# Altium project HV_BMS.PrjPcb (part 1 of 2)
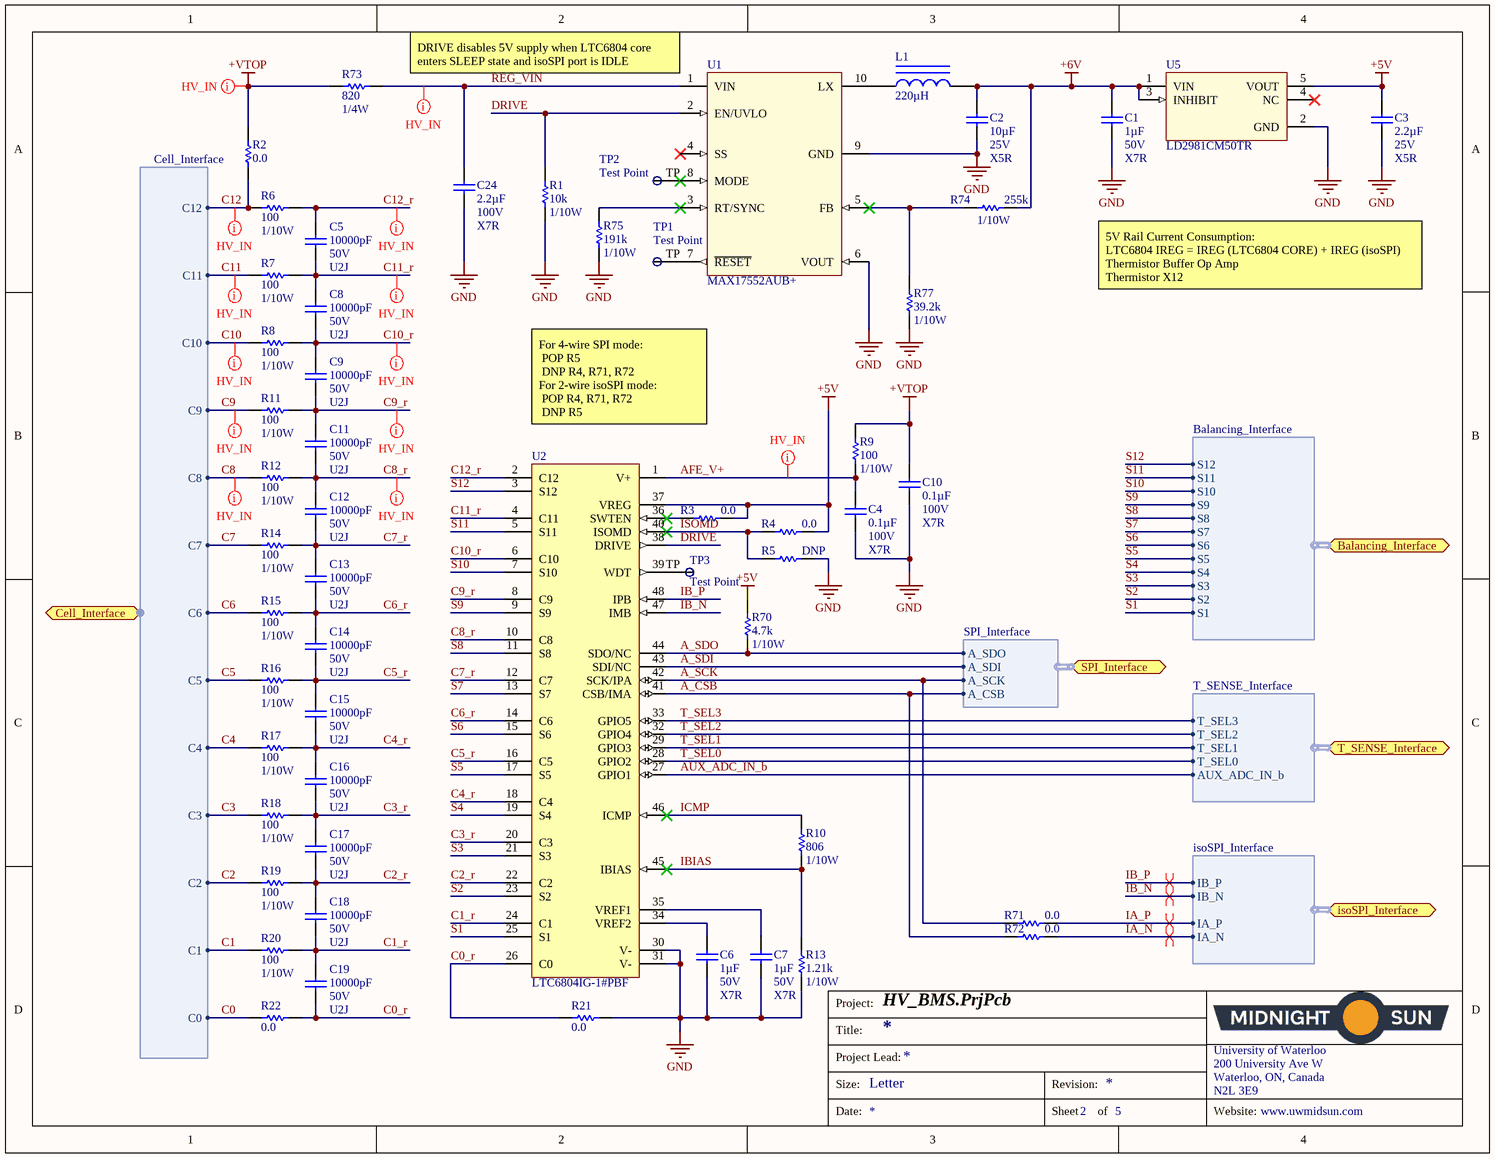
[diagram p0: AFE.SchDoc]
5 sheets, 128 parts. Net scope: flat (ports and power ports of the same name join across sheets).
Board file: AFE.PcbDoc
Sheets:
  BlockDiagram.SchDoc
  AFE.SchDoc
  Cell+Balancing_Interface.SchDoc
  Thermistor_Interface.SchDoc
  isoSPI_Interface.SchDoc

## Sheet BlockDiagram.SchDoc
size Letter

## Sheet AFE.SchDoc
size Letter; DocumentNumber: 2; SheetNumber: 2; SheetTotal: 5; Website: www.uwmidsun.com

### Parts
C1  Capacitance: 1µF  Voltage: 50V  Temperature Coefficient: X7R  [CAP, 0603]  (hidden comment: CAP CER 1UF 50V 10% X7R 0603)
C2  Capacitance: 10µF  Voltage: 25V  Temperature Coefficient: X5R  [CAP, 0603]  (hidden comment: CAP CER 10uF 25V 20% X5R 0603)
C3  Capacitance: 2.2µF  Voltage: 25V  Temperature Coefficient: X5R  [CAP, 0603]  (hidden comment: CAP CER 2.2UF 25V 10% X5R 0603)
C4  Capacitance: 0.1µF  Voltage: 100V  Temperature Coefficient: X7R  [CAP, 0805]  (hidden comment: CAP CER 0.1UF 100V 10% X7R 0805)
C5  Capacitance: 10000pF  Voltage: 50V  Temperature Coefficient: U2J  [CAP, 0603]  (hidden comment: CAP CER 10nF 50V 5% X7R 0603)
C6  Capacitance: 1µF  Voltage: 50V  Temperature Coefficient: X7R  [CAP, 0603]  (hidden comment: CAP CER 1UF 50V 10% X7R 0603)
C7  Capacitance: 1µF  Voltage: 50V  Temperature Coefficient: X7R  [CAP, 0603]  (hidden comment: CAP CER 1UF 50V 10% X7R 0603)
C8  Capacitance: 10000pF  Voltage: 50V  Temperature Coefficient: U2J  [CAP, 0603]  (hidden comment: CAP CER 10nF 50V 5% X7R 0603)
C9  Capacitance: 10000pF  Voltage: 50V  Temperature Coefficient: U2J  [CAP, 0603]  (hidden comment: CAP CER 10nF 50V 5% X7R 0603)
C10  Capacitance: 0.1µF  Voltage: 100V  Temperature Coefficient: X7R  [CAP, 0805]  (hidden comment: CAP CER 0.1UF 100V 10% X7R 0805)
C11  Capacitance: 10000pF  Voltage: 50V  Temperature Coefficient: U2J  [CAP, 0603]  (hidden comment: CAP CER 10nF 50V 5% X7R 0603)
C12  Capacitance: 10000pF  Voltage: 50V  Temperature Coefficient: U2J  [CAP, 0603]  (hidden comment: CAP CER 10nF 50V 5% X7R 0603)
C13  Capacitance: 10000pF  Voltage: 50V  Temperature Coefficient: U2J  [CAP, 0603]  (hidden comment: CAP CER 10nF 50V 5% X7R 0603)
C14  Capacitance: 10000pF  Voltage: 50V  Temperature Coefficient: U2J  [CAP, 0603]  (hidden comment: CAP CER 10nF 50V 5% X7R 0603)
C15  Capacitance: 10000pF  Voltage: 50V  Temperature Coefficient: U2J  [CAP, 0603]  (hidden comment: CAP CER 10nF 50V 5% X7R 0603)
C16  Capacitance: 10000pF  Voltage: 50V  Temperature Coefficient: U2J  [CAP, 0603]  (hidden comment: CAP CER 10nF 50V 5% X7R 0603)
C17  Capacitance: 10000pF  Voltage: 50V  Temperature Coefficient: U2J  [CAP, 0603]  (hidden comment: CAP CER 10nF 50V 5% X7R 0603)
C18  Capacitance: 10000pF  Voltage: 50V  Temperature Coefficient: U2J  [CAP, 0603]  (hidden comment: CAP CER 10nF 50V 5% X7R 0603)
C19  Capacitance: 10000pF  Voltage: 50V  Temperature Coefficient: U2J  [CAP, 0603]  (hidden comment: CAP CER 10nF 50V 5% X7R 0603)
C24  Capacitance: 2.2µF  Voltage: 100V  Temperature Coefficient: X7R  [CAP, 1206]  (hidden comment: CAP CER 2.2UF 100V ±20% X7R 1206)
L1  Inductance: 220µH  [INDP6060X23N]  (hidden comment: IND 220uH 0.59A 20%)
R1  Resistance: 10k  Power: 1/10W  [RES, 0603]  (hidden comment: RES 10K OHM 1% 1/10W 0603)
R2  Resistance: 0.0  [RES, 0603]  (hidden comment: RES 0.0 OHM 1/4W 0603)
R3  Resistance: 0.0  [RES, 0603]  (hidden comment: RES 0.0 OHM 1/4W 0603)
R4  Resistance: 0.0  [RES, 0603]  (hidden comment: RES 0.0 OHM 1/4W 0603)
R5  Resistance: DNP  [RES, 0603]  (hidden comment: RES 0.0 OHM 1/4W 0603)
R6  Resistance: 100  Power: 1/10W  [RES, 0603]  (hidden comment: RES 100 OHM 1% 1/10W 0603)
R7  Resistance: 100  Power: 1/10W  [RES, 0603]  (hidden comment: RES 100 OHM 1% 1/10W 0603)
R8  Resistance: 100  Power: 1/10W  [RES, 0603]  (hidden comment: RES 100 OHM 1% 1/10W 0603)
R9  Resistance: 100  Power: 1/10W  [RES, 0603]  (hidden comment: RES 100 OHM 1% 1/10W 0603)
R10  Resistance: 806  Power: 1/10W  [RES, 0603]  (hidden comment: RES 806 OHM 1% 1/10W 0603)
R11  Resistance: 100  Power: 1/10W  [RES, 0603]  (hidden comment: RES 100 OHM 1% 1/10W 0603)
R12  Resistance: 100  Power: 1/10W  [RES, 0603]  (hidden comment: RES 100 OHM 1% 1/10W 0603)
R13  Resistance: 1.21k  Power: 1/10W  [RES, 0603]  (hidden comment: RES 1.21K OHM 1% 1/10W 0603)
R14  Resistance: 100  Power: 1/10W  [RES, 0603]  (hidden comment: RES 100 OHM 1% 1/10W 0603)
R15  Resistance: 100  Power: 1/10W  [RES, 0603]  (hidden comment: RES 100 OHM 1% 1/10W 0603)
R16  Resistance: 100  Power: 1/10W  [RES, 0603]  (hidden comment: RES 100 OHM 1% 1/10W 0603)
R17  Resistance: 100  Power: 1/10W  [RES, 0603]  (hidden comment: RES 100 OHM 1% 1/10W 0603)
R18  Resistance: 100  Power: 1/10W  [RES, 0603]  (hidden comment: RES 100 OHM 1% 1/10W 0603)
R19  Resistance: 100  Power: 1/10W  [RES, 0603]  (hidden comment: RES 100 OHM 1% 1/10W 0603)
R20  Resistance: 100  Power: 1/10W  [RES, 0603]  (hidden comment: RES 100 OHM 1% 1/10W 0603)
R21  Resistance: 0.0  [RES, 0603]  (hidden comment: RES 0.0 OHM 1/4W 0603)
R22  Resistance: 0.0  [RES, 0603]  (hidden comment: RES 0.0 OHM 1/4W 0603)
R70  Resistance (Ohms): 4.7k  Power (Watts): 1/10W  [RES, 0603]  (hidden comment: RES 4.7K OHM 1% 1/10W 0603)
R71  Resistance: 0.0  [RES, 0603]  (hidden comment: RES 0.0 OHM 1/4W 0603)
R72  Resistance: 0.0  [RES, 0603]  (hidden comment: RES 0.0 OHM 1/4W 0603)
R73  Resistance: 820  Power: 1/4W  [RES, 0603]  (hidden comment: RES 820 OHM 5% 1/4W 0603)
R74  Resistance (Ohms): 255k  Power (Watts): 1/10W  [RES, 0603]  (hidden comment: RES 255K OHM 1% 1/10W 0603)
R75  Resistance: 191k  Power: 1/10W  [RES, 0603]  (hidden comment: RES 191K OHM 1% 1/10W 0603)
R77  Resistance: 39.2k  Power: 1/10W  [RES, 0603]  (hidden comment: RES 39.2K OHM 1% 1/10W 0603)
TP1  Test Point  [Test Point]
TP2  Test Point  [Test Point]
TP3  Test Point  [Test Point]
U1  Manufacturer Part Number 1: MAX17552AUB+  [TSSOP50P490X110-10N]  (hidden comment: IC REG BUCK ADJ 0.1A 10UMAX)
U2  Manufacturer Part Number 1: LTC6804IG-1#PBF  [SSOP50P780X200-48N]  (hidden comment: IC MONITOR BATT STACK 48SSOP)
U5  Manufacturer Part Number 1: LD2981CM50TR  [SOT95P280X145-5N]  (hidden comment: IC REG LDO 5V 0.1A SOT23-5)

### Ports
Balancing_Interface (harness Balancing_Interface), Cell_Interface (harness Cell_Interface), isoSPI_Interface (harness isoSPI_Interface), SPI_Interface (harness SPI_Interface), T_SENSE_Interface (harness T_SENSE_Interface)

### Harnesses
T_SENSE_Interface: AUX_ADC_IN_b, T_SEL0, T_SEL1, T_SEL2, T_SEL3
isoSPI_Interface: IB_P, IB_N, IA_P, IA_N
Cell_Interface: C12, C11, C10, C9, C8, C7, C6, C5, C4, C3, C2, C1, C0
Balancing_Interface: S12, S11, S10, S9, S8, S7, S6, S5, S4, S3, S2, S1
SPI_Interface: A_SDO, A_SDI, A_SCK, A_CSB

### Nets
+5V: C3.1 R3.1 R4.2 R70.1 U2.37(VREG) U5.5(VOUT)
+6V: C1.1 C2.1 L1.2 R74.2 U5.1(VIN) U5.3(INHIBIT)
+VTOP: C10.1 R2.1 R9.1 R73.1
GND: C1.2 C2.2 C3.2 C4.2 C6.2 C7.2 C10.2 C24.2 R1.2 R5.1 R13.2 R21.2 R75.2 R77.2 U1.6(VOUT) U1.9(GND) U2.30(V-) U2.31(V-) U5.2(GND)
A_CSB: R72.2 U2.41(CSB/IMA) ; port SPI_Interface.A_CSB
A_SCK: R71.2 U2.42(SCK/IPA) ; port SPI_Interface.A_SCK
A_SDI: U2.43(SDI/NC) ; port SPI_Interface.A_SDI
A_SDO: R70.2 U2.44(SDO/NC) ; port SPI_Interface.A_SDO
AFE_V+: C4.1 R9.2 U2.1(V+)
AUX_ADC_IN_b: U2.27(GPIO1) ; port T_SENSE_Interface.AUX_ADC_IN_b
C0: R22.1 ; port Cell_Interface.C0
C0_r: C19.2 R21.1 R22.2 U2.26(C0)
C1: R20.1 ; port Cell_Interface.C1
C1_r: C18.2 C19.1 R20.2 U2.24(C1)
C2: R19.1 ; port Cell_Interface.C2
C2_r: C17.2 C18.1 R19.2 U2.22(C2)
C3: R18.1 ; port Cell_Interface.C3
C3_r: C16.2 C17.1 R18.2 U2.20(C3)
C4: R17.1 ; port Cell_Interface.C4
C4_r: C15.2 C16.1 R17.2 U2.18(C4)
C5: R16.1 ; port Cell_Interface.C5
C5_r: C14.2 C15.1 R16.2 U2.16(C5)
C6: R15.1 ; port Cell_Interface.C6
C6_r: C13.2 C14.1 R15.2 U2.14(C6)
C7: R14.1 ; port Cell_Interface.C7
C7_r: C12.2 C13.1 R14.2 U2.12(C7)
C8: R12.1 ; port Cell_Interface.C8
C8_r: C11.2 C12.1 R12.2 U2.10(C8)
C9: R11.1 ; port Cell_Interface.C9
C9_r: C9.2 C11.1 R11.2 U2.8(C9)
C10: R8.1 ; port Cell_Interface.C10
C10_r: C8.2 C9.1 R8.2 U2.6(C10)
C11: R7.1 ; port Cell_Interface.C11
C11_r: C5.2 C8.1 R7.2 U2.4(C11)
C12: R2.2 R6.1 ; port Cell_Interface.C12
C12_r: C5.1 R6.2 U2.2(C12)
DRIVE: R1.1 U1.2(EN/UVLO) U2.38(DRIVE)
IA_N: R72.1 ; port isoSPI_Interface.IA_N
IA_P: R71.1 ; port isoSPI_Interface.IA_P
IB_N: U2.47(IMB) ; port isoSPI_Interface.IB_N
IB_P: U2.48(IPB) ; port isoSPI_Interface.IB_P
IBIAS: R10.2 R13.1 U2.45(IBIAS)
ICMP: R10.1 U2.46(ICMP)
ISOMD: R4.1 R5.2 U2.40(ISOMD)
REG_VIN: C24.1 R73.2 U1.1(VIN)
S1: U2.25(S1) ; port Balancing_Interface.S1
S2: U2.23(S2) ; port Balancing_Interface.S2
S3: U2.21(S3) ; port Balancing_Interface.S3
S4: U2.19(S4) ; port Balancing_Interface.S4
S5: U2.17(S5) ; port Balancing_Interface.S5
S6: U2.15(S6) ; port Balancing_Interface.S6
S7: U2.13(S7) ; port Balancing_Interface.S7
S8: U2.11(S8) ; port Balancing_Interface.S8
S9: U2.9(S9) ; port Balancing_Interface.S9
S10: U2.7(S10) ; port Balancing_Interface.S10
S11: U2.5(S11) ; port Balancing_Interface.S11
S12: U2.3(S12) ; port Balancing_Interface.S12
T_SEL0: U2.28(GPIO2) ; port T_SENSE_Interface.T_SEL0
T_SEL1: U2.29(GPIO3) ; port T_SENSE_Interface.T_SEL1
T_SEL2: U2.32(GPIO4) ; port T_SENSE_Interface.T_SEL2
T_SEL3: U2.33(GPIO5) ; port T_SENSE_Interface.T_SEL3
NetC6_1: C6.1 U2.34(VREF2)
NetC7_1: C7.1 U2.35(VREF1)
NetL1_1: L1.1 U1.10(LX)
NetR3_2: R3.2 U2.36(SWTEN)
NetR74_1: R74.1 R77.1 U1.5(FB)
NetR75_1: R75.1 U1.3(RT/SYNC)
NetTP1_TP: TP1.TP U1.7(~{RESET})
NetTP2_TP: TP2.TP U1.8(MODE)
NetTP3_TP: TP3.TP U2.39(WDT)

Not connected (* = marked no-connect by the designer): U1 4(SS)*; U5 4(NC)*

### Layout directives
differential pair: IA_N, IA_P, IB_N, IB_P
net class HV_IN: +VTOP, AFE_V+, C8, C8_r, C9, C9_r, C10, C10_r, C11, C11_r, C12, C12_r, REG_VIN

### Notes on the sheet
- DRIVE disables 5V supply when LTC6804 core enters SLEEP state and isoSPI port is IDLE
- 5V Rail Current Consumption:
  LTC6804 IREG = IREG (LTC6804 CORE) + IREG (isoSPI)
  Thermistor Buffer Op Amp
  Thermistor X12
- For 4-wire SPI mode:
  POP R5
  DNP R4, R71, R72
  For 2-wire isoSPI mode:
  POP R4, R71, R72
  DNP R5
- Project:
- Title:
- Size:
- Project Lead:
- Letter
- Revision:
- University of Waterloo
- 200 University Ave W
- Waterloo, ON, Canada
- N2L 3E9
- Date:
- Sheet
- of
- Website:

### Library data of the parts
C1 C6 C7 = CAP CER 1UF 50V 10% X7R 0603: 1µF ±10% 50V Ceramic Capacitor X7R 0603 (1608 Metric); Manufacturer 1: Taiyo Yuden; Manufacturer Part Number 1: UMK107AB7105KA-T; Supplier 1: Digi-Key; Supplier Part Number 1: 587-3247-1-ND; Packaging: Cut Tape (CT); Part Status: Active; Operating Temperature: -55°C ~ 125°C; Ratings: -; Mounting Type: Surface Mount, MLCC; Package / Case: 0603 (1608 Metric); Size / Dimension: 0.063" L x 0.031" W (1.60mm x 0.80mm); Height - Seated (Max): -; Thickness (Max): 0.037" (0.95mm); Lead Spacing: -; Lead Style: -; ComponentLink1URL: http://www.yuden.co.jp/productdata/catalog/en/mlcc_all_e.pdf; ComponentLink1Description: http://www.yuden.co.jp/productdata/catalog/en/mlcc_all_e.pdf; Tolerance: ±10%
C2 = CAP CER 10uF 25V 20% X5R 0603: 10µF ±20% 25V Ceramic Capacitor X5R 0603 (1608 Metric); Manufacturer 1: Murata Electronics North America; Manufacturer Part Number 1: GRM188R61E106MA73D; Supplier 1: Digi-Key; Supplier Part Number 1: 490-7202-1-ND; Packaging: Cut Tape (CT); Part Status: Active; Operating Temperature: -55°C ~ 85°C; Ratings: -; Mounting Type: Surface Mount, MLCC; Package / Case: 0603 (1608 Metric); Size / Dimension: 0.063" L x 0.031" W (1.60mm x 0.80mm); Height - Seated (Max): -; Thickness (Max): 0.031" (0.80mm); Lead Spacing: -; Lead Style: -; ComponentLink1URL: http://www.murata.com/~/media/webrenewal/support/library/catalog/products/capacitor/mlcc/c02e.ashx; ComponentLink1Description: http://www.murata.com/~/media/webrenewal/support/library/catalog/products/capacitor/mlcc/c02e.ashx; Tolerance: ±20%
C3 = CAP CER 2.2UF 25V 10% X5R 0603: 2.2µF ±10% 25V Ceramic Capacitor X5R 0603 (1608 Metric); Manufacturer 1: Murata Electronics North America; Manufacturer Part Number 1: GRM188R61E225KA12D; Supplier 1: Digi-Key; Supplier Part Number 1: 490-10731-1-ND; Packaging: Cut Tape (CT); Part Status: Active; Operating Temperature: -55°C ~ 85°C; Ratings: -; Mounting Type: Surface Mount, MLCC; Package / Case: 0603 (1608 Metric); Size / Dimension: 0.063" L x 0.031" W (1.60mm x 0.80mm); Height - Seated (Max): -; Thickness (Max): 0.035" (0.90mm); Lead Spacing: -; Lead Style: -; ComponentLink1URL: http://www.murata.com/~/media/webrenewal/support/library/catalog/products/capacitor/mlcc/c02e.ashx; ComponentLink1Description: http://www.murata.com/~/media/webrenewal/support/library/catalog/products/capacitor/mlcc/c02e.ashx; Tolerance: ±10%
C4 C10 = CAP CER 0.1UF 100V 10% X7R 0805: 0.1µF ±10% 100V Ceramic Capacitor X7R 0805 (2012 Metric); Manufacturer 1: Murata Electronics North America; Manufacturer Part Number 1: GCM21BR72A104KA37L; Supplier 1: Digi-Key; Supplier Part Number 1: 490-4789-1-ND; Packaging: Cut Tape (CT); Part Status: Active; Operating Temperature: -55°C ~ 125°C; Ratings: AEC-Q200; Mounting Type: Surface Mount, MLCC; Package / Case: 0805 (2012 Metric); Size / Dimension: 0.079" L x 0.049" W (2.00mm x 1.25mm); Height - Seated (Max): -; Thickness (Max): 0.055" (1.40mm); Lead Spacing: -; Lead Style: -; ComponentLink1URL: http://www.murata.com/~/media/webrenewal/support/library/catalog/products/capacitor/mlcc/c03e.ashx; ComponentLink1Description: http://www.murata.com/~/media/webrenewal/support/library/catalog/products/capacitor/mlcc/c03e.ashx; Tolerance: ±10%
C5 C8 C9 C11-C19 = CAP CER 10nF 50V 5% X7R 0603: 10000pF ±5% 50V Ceramic Capacitor U2J 0603 (1608 Metric); Manufacturer 1: KEMET; Manufacturer Part Number 1: C0603C103J5JAC7867; Supplier 1: Digi-Key; Supplier Part Number 1: 399-13384-1-ND; Packaging: Cut Tape (CT); Part Status: Active; Operating Temperature: -55°C ~ 125°C; Ratings: -; Failure Rate: -; Mounting Type: Surface Mount, MLCC; Package / Case: 0603 (1608 Metric); Size / Dimension: 0.063" L x 0.032" W (1.60mm x 0.80mm); Height - Seated (Max): -; Thickness (Max): 0.034" (0.87mm); Lead Spacing: -; Lead Style: -; ComponentLink1URL: http://www.kemet.com/docfinder?Partnumber=C0603C103J5JAC7867; ComponentLink1Description: http://www.kemet.com/docfinder?Partnumber=C0603C103J5JAC7867; Tolerance: ±5%
C24 = CAP CER 2.2UF 100V ±20% X7R 1206: 2.2µF ±20% 100V Ceramic Capacitor X7R 1206 (3216 Metric); Manufacturer 1: Murata Electronics North America; Manufacturer Part Number 1: GRM31CR72A225MA73L; Supplier 1: Digi-Key; Supplier Part Number 1: 490-12773-1-ND; Packaging: Cut Tape (CT); Part Status: Active; Operating Temperature: -55°C ~ 125°C; Ratings: -; Mounting Type: Surface Mount, MLCC; Package / Case: 1206 (3216 Metric); Size / Dimension: 0.126" L x 0.063" W (3.20mm x 1.60mm); Height - Seated (Max): -; Thickness (Max): 0.071" (1.80mm); Lead Spacing: -; Lead Style: -; ComponentLink1URL: http://www.murata.com/~/media/webrenewal/support/library/catalog/products/capacitor/mlcc/c02e.ashx; ComponentLink1Description: http://www.murata.com/~/media/webrenewal/support/library/catalog/products/capacitor/mlcc/c02e.ashx; Tolerance: ±20%
L1 = IND 220uH 0.59A 20%: 220µH Shielded Inductor 590mA 834 mOhm Nonstandard; Manufacturer 1: Laird-Signal Integrity Products; Manufacturer Part Number 1: TYS6045221M-10; Current - Saturation: 700mA; Frequency - Self Resonant: 3.5MHz; Supplier 1: Digi-Key; Supplier Part Number 1: 240-2742-1-ND; Packaging: Cut Tape (CT); Part Status: Active; Type: -; Material - Core: -; Current Rating: 590mA; Shielding: Shielded; DC Resistance (DCR): 834 mOhm; Q @ Freq: -; Ratings: AEC-Q200; Operating Temperature: -40°C ~ 125°C; Mounting Type: Surface Mount; Package / Case: Nonstandard; Supplier Device Package: -; Size / Dimension: 0.236" L x 0.236" W (6.00mm x 6.00mm); Height - Seated (Max): 0.185" (4.70mm); ComponentLink1URL: http://assets.lairdtech.com/home/brandworld/files/TYS6045221M-10.pdf; ComponentLink1Description: http://assets.lairdtech.com/home/brandworld/files/TYS6045221M-10.pdf; Tolerance: ±20%
R1 = RES 10K OHM 1% 1/10W 0603: RES SMD 10K OHM 1% 1/10W 0603; Manufacturer 1: Yageo; Manufacturer Part Number 1: RC0603FR-0710KL; Temperature Coefficient: ±100ppm/°C; Supplier 1: Digi-Key; Supplier Part Number 1: 311-10.0KHRCT-ND; Packaging: Cut Tape (CT); Part Status: Active; Composition: Thick Film; Operating Temperature: -55°C ~ 155°C; Package / Case: 0603 (1608 Metric); Supplier Device Package: 0603; Size / Dimension: 0.063" L x 0.031" W (1.60mm x 0.80mm); Height - Seated (Max): 0.022" (0.55mm); Failure Rate: -; ComponentLink1URL: http://www.yageo.com/documents/recent/PYu-RC_Group_51_RoHS_L_7.pdf; ComponentLink1Description: http://www.yageo.com/documents/recent/PYu-RC_Group_51_RoHS_L_7.pdf; Tolerance: ±1%
R2-R5 R21 R22 R71 R72 = RES 0.0 OHM 1/4W 0603: RES SMD 0.0 OHM JUMPER 1/4W 0603; Manufacturer 1: Vishay Dale; Manufacturer Part Number 1: CRCW06030000Z0EAHP; Supplier 1: Digi-Key; Supplier Part Number 1: 541-0.0SBCT-ND; Packaging: Cut Tape (CT); Part Status: Active; Composition: Thick Film; Operating Temperature: -55°C ~ 155°C; Package / Case: 0603 (1608 Metric); Supplier Device Package: 0603; Size / Dimension: 0.063" L x 0.033" W (1.60mm x 0.85mm); Height - Seated (Max): 0.022" (0.55mm); Failure Rate: -; ComponentLink1URL: http://www.vishay.com/docs/20043/crcwhpe3.pdf; ComponentLink1Description: http://www.vishay.com/docs/20043/crcwhpe3.pdf; Power (Watts): 1/4W
R6-R9 R11 R12 R14-R20 = RES 100 OHM 1% 1/10W 0603: 100 Ohm ±1% 0.1W, 1/10W Chip Resistor 0603 (1608 Metric) Moisture Resistant Thick Film; Manufacturer 1: Yageo; Manufacturer Part Number 1: RC0603FR-07100RL; Temperature Coefficient: ±100ppm/°C; Supplier 1: Digi-Key; Supplier Part Number 1: 311-100HRCT-ND; Packaging: Cut Tape (CT); Part Status: Active; Composition: Thick Film; Operating Temperature: -55°C ~ 155°C; Package / Case: 0603 (1608 Metric); Supplier Device Package: 0603; Size / Dimension: 0.063" L x 0.031" W (1.60mm x 0.80mm); Height - Seated (Max): 0.022" (0.55mm); Failure Rate: -; ComponentLink1URL: http://www.yageo.com/documents/recent/PYu-RC_Group_51_RoHS_L_7.pdf; ComponentLink1Description: http://www.yageo.com/documents/recent/PYu-RC_Group_51_RoHS_L_7.pdf; Tolerance: ±1%
R10 = RES 806 OHM 1% 1/10W 0603: 806 Ohm ±1% 0.1W, 1/10W Chip Resistor 0603 (1608 Metric) Moisture Resistant Thick Film; Manufacturer 1: Yageo; Manufacturer Part Number 1: RC0603FR-07806RL; Temperature Coefficient: ±100ppm/°C; Supplier 1: Digi-Key; Supplier Part Number 1: 311-806HRCT-ND; Packaging: Cut Tape (CT); Part Status: Active; Composition: Thick Film; Operating Temperature: -55°C ~ 155°C; Package / Case: 0603 (1608 Metric); Supplier Device Package: 0603; Size / Dimension: 0.063" L x 0.031" W (1.60mm x 0.80mm); Height - Seated (Max): 0.022" (0.55mm); Failure Rate: -; ComponentLink1URL: http://www.yageo.com/documents/recent/PYu-RC_Group_51_RoHS_L_7.pdf; ComponentLink1Description: http://www.yageo.com/documents/recent/PYu-RC_Group_51_RoHS_L_7.pdf; Tolerance: ±1%
R13 = RES 1.21K OHM 1% 1/10W 0603: 1.21k Ohm ±1% 0.1W, 1/10W Chip Resistor 0603 (1608 Metric) Moisture Resistant Thick Film; Manufacturer 1: Yageo; Manufacturer Part Number 1: RC0603FR-071K21L; Temperature Coefficient: ±100ppm/°C; Supplier 1: Digi-Key; Supplier Part Number 1: 311-1.21KHRCT-ND; Packaging: Cut Tape (CT); Part Status: Active; Composition: Thick Film; Operating Temperature: -55°C ~ 155°C; Package / Case: 0603 (1608 Metric); Supplier Device Package: 0603; Size / Dimension: 0.063" L x 0.031" W (1.60mm x 0.80mm); Height - Seated (Max): 0.022" (0.55mm); Failure Rate: -; ComponentLink1URL: http://www.yageo.com/documents/recent/PYu-RC_Group_51_RoHS_L_7.pdf; ComponentLink1Description: http://www.yageo.com/documents/recent/PYu-RC_Group_51_RoHS_L_7.pdf; Tolerance: ±1%
R70 = RES 4.7K OHM 1% 1/10W 0603: 4.7k Ohm ±1% 0.1W, 1/10W Chip Resistor 0603 (1608 Metric) Moisture Resistant Thick Film; Manufacturer 1: Yageo; Manufacturer Part Number 1: RC0603FR-074K7L; Description 1: RES SMD 4.7K OHM 1% 1/10W 0603; Temperature Coefficient: ±100ppm/°C; Supplier 1: Digi-Key; Supplier Part Number 1: 311-4.70KHRCT-ND; RoHS: RoHS Compliant; Category: Resistors; Stock 1: 3487566; Pricing 1: 1=0.16, 10=0.022, 100=0.0089, 1000=0.00402, 2500=0.00349 (CAD); Packaging: Cut Tape (CT); Part Status: Active; Composition: Thick Film; Features: Moisture Resistant; Operating Temperature: -55°C ~ 155°C; Package / Case: 0603 (1608 Metric); Supplier Device Package: 0603; Size / Dimension: 0.063" L x 0.031" W (1.60mm x 0.80mm); Height - Seated (Max): 0.022" (0.55mm); Failure Rate: -; ComponentLink1URL: http://www.yageo.com/documents/recent/PYu-RC_Group_51_RoHS_L_7.pdf; ComponentLink1Description: http://www.yageo.com/documents/recent/PYu-RC_Group_51_RoHS_L_7.pdf; Tolerance: ±1%
R73 = RES 820 OHM 5% 1/4W 0603: RES SMD 820 OHM 5% 1/4W 0603; Manufacturer 1: Rohm Semiconductor; Manufacturer Part Number 1: ESR03EZPJ821; Temperature Coefficient: ±200ppm/°C; Supplier 1: Digi-Key; Supplier Part Number 1: RHM820DCT-ND; Packaging: Cut Tape (CT); Part Status: Active; Composition: Thick Film; Operating Temperature: -55°C ~ 155°C; Package / Case: 0603 (1608 Metric); Supplier Device Package: 0603; Size / Dimension: 0.063" L x 0.031" W (1.60mm x 0.80mm); Height - Seated (Max): 0.022" (0.55mm); Failure Rate: -; ComponentLink1URL: http://www.rohm.com/web/global/datasheet/ESR01MZPF/esr-e; ComponentLink1Description: http://www.rohm.com/web/global/datasheet/ESR01MZPF/esr-e; Tolerance: ±5%
R74 = RES 255K OHM 1% 1/10W 0603: 255k Ohm ±1% 0.1W, 1/10W Chip Resistor 0603 (1608 Metric) Moisture Resistant Thick Film; Manufacturer 1: Yageo; Manufacturer Part Number 1: RC0603FR-07255KL; Description 1: RES SMD 255K OHM 1% 1/10W 0603; Temperature Coefficient: ±100ppm/°C; Supplier 1: Digi-Key; Supplier Part Number 1: 311-255KHRCT-ND; RoHS: RoHS Compliant; Category: Resistors; Stock 1: 106564; Pricing 1: 1=0.16, 10=0.022, 100=0.0089, 1000=0.00402, 2500=0.00349 (CAD); Packaging: Cut Tape (CT); Part Status: Active; Composition: Thick Film; Features: Moisture Resistant; Operating Temperature: -55°C ~ 155°C; Package / Case: 0603 (1608 Metric); Supplier Device Package: 0603; Size / Dimension: 0.063" L x 0.031" W (1.60mm x 0.80mm); Height - Seated (Max): 0.022" (0.55mm); Failure Rate: -; ComponentLink1URL: http://www.yageo.com/documents/recent/PYu-RC_Group_51_RoHS_L_7.pdf; ComponentLink1Description: http://www.yageo.com/documents/recent/PYu-RC_Group_51_RoHS_L_7.pdf; Tolerance: ±1%
R75 = RES 191K OHM 1% 1/10W 0603: 191k Ohm ±1% 0.1W, 1/10W Chip Resistor 0603 (1608 Metric) Moisture Resistant Thick Film; Manufacturer 1: Yageo; Manufacturer Part Number 1: RC0603FR-07191KL; Temperature Coefficient: ±100ppm/°C; Supplier 1: Digi-Key; Supplier Part Number 1: 311-191KHRCT-ND; Packaging: Cut Tape (CT); Part Status: Active; Composition: Thick Film; Operating Temperature: -55°C ~ 155°C; Package / Case: 0603 (1608 Metric); Supplier Device Package: 0603; Size / Dimension: 0.063" L x 0.031" W (1.60mm x 0.80mm); Height - Seated (Max): 0.022" (0.55mm); Failure Rate: -; ComponentLink1URL: http://www.yageo.com/documents/recent/PYu-RC_Group_51_RoHS_L_7.pdf; ComponentLink1Description: http://www.yageo.com/documents/recent/PYu-RC_Group_51_RoHS_L_7.pdf; Tolerance: ±1%
R77 = RES 39.2K OHM 1% 1/10W 0603: 39.2k Ohm ±1% 0.1W, 1/10W Chip Resistor 0603 (1608 Metric) Moisture Resistant Thick Film; Manufacturer 1: Yageo; Manufacturer Part Number 1: RC0603FR-0739K2L; Temperature Coefficient: ±100ppm/°C; Supplier 1: Digi-Key; Supplier Part Number 1: 311-39.2KHRCT-ND; Packaging: Cut Tape (CT); Part Status: Active; Composition: Thick Film; Operating Temperature: -55°C ~ 155°C; Package / Case: 0603 (1608 Metric); Supplier Device Package: 0603; Size / Dimension: 0.063" L x 0.031" W (1.60mm x 0.80mm); Height - Seated (Max): 0.022" (0.55mm); Failure Rate: -; ComponentLink1URL: http://www.yageo.com/documents/recent/PYu-RC_Group_51_RoHS_L_7.pdf; ComponentLink1Description: http://www.yageo.com/documents/recent/PYu-RC_Group_51_RoHS_L_7.pdf; Tolerance: ±1%
U1 = IC REG BUCK ADJ 0.1A 10UMAX: Buck Switching Regulator IC Positive Adjustable 0.8V 1 Output 100mA 10-TFSOP, 10-MSOP (0.118", 3.00mm Width); Manufacturer 1: Maxim Integrated; Function: Step-Down; Number of Outputs: 1; Voltage - Input (Min): 4V; Voltage - Input (Max): 60V; Voltage - Output (Max): 54V; Frequency - Switching: 100kHz ~ 2.2MHz; Synchronous Rectifier: Yes; Supplier 1: Digi-Key; Supplier Part Number 1: MAX17552AUB+-ND; Packaging: Tube; Part Status: Active; Output Configuration: Positive; Topology: Buck; Output Type: Adjustable; Voltage - Output (Min/Fixed): 0.8V; Current - Output: 100mA; Operating Temperature: -40°C ~ 125°C (TJ); Mounting Type: Surface Mount; Package / Case: 10-TFSOP, 10-MSOP (0.118", 3.00mm Width); Supplier Device Package: 10-uMAX; ComponentLink1URL: http://datasheets.maximintegrated.com/en/ds/MAX17552.pdf; ComponentLink1Description: http://datasheets.maximintegrated.com/en/ds/MAX17552.pdf
U2 = IC MONITOR BATT STACK 48SSOP: Battery Battery Monitor IC Multi-Chemistry 48-SSOP; Manufacturer 1: Linear Technology; Number of Cells: 1 ~ 12; Fault Protection: Over/Under Voltage; Interface: I²C, SPI; Supplier 1: Digi-Key; Supplier Part Number 1: LTC6804IG-1#PBF-ND; Packaging: Tube; Part Status: Active; Function: Battery Monitor; Battery Chemistry: Multi-Chemistry; Operating Temperature: -40°C ~ 85°C (TA); Package / Case: 48-FSOP (0.209", 5.30mm Width); Supplier Device Package: 48-SSOP; ComponentLink1URL: http://www.linear.com/docs/43171; ComponentLink1Description: http://www.linear.com/docs/43171
U5 = IC REG LDO 5V 0.1A SOT23-5: Linear Voltage Regulator IC Positive Fixed Output 5V 100mA SOT-23-5; Manufacturer 1: STMicroelectronics; Voltage - Dropout (Typical): 0.18V @ 100mA; Voltage - Input: Up to 16V; Supplier 1: Digi-Key; Supplier Part Number 1: 497-7787-1-ND; Packaging: Cut Tape (CT); Part Status: Active; Regulator Topology: Positive Fixed; Voltage - Output: 5V; Current - Output: 100mA; Current - Limit (Min): -; Operating Temperature: -40°C ~ 125°C; Mounting Type: Surface Mount; Package / Case: SC-74A, SOT-753; Supplier Device Package: SOT-23-5; ComponentLink1URL: http://www.st.com/content/ccc/resource/technical/document/datasheet/group1/b7/b5/a1/83/9c/bd/4a/90/CD00001635/files/CD00001635.pdf/jcr:content/translations/en.CD00001635.pdf; ComponentLink1Description: http://www.st.com/content/ccc/resource/technical/document/datasheet/group1/b7/b5/a1/83/9c/bd/4a/90/CD00001635/files/CD00001635.pdf/jcr:content/translations/en.CD00001635.pdf

## Sheet Cell+Balancing_Interface.SchDoc
size Letter; Website: www.uwmidsun.com
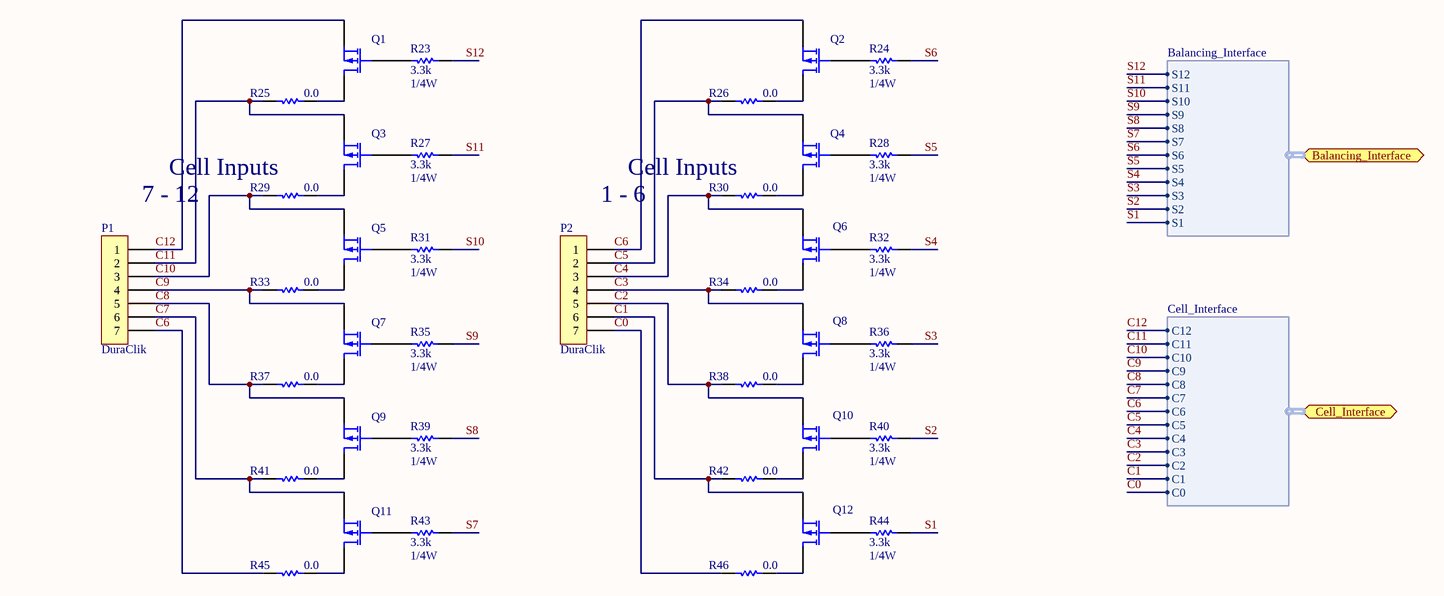
[diagram p1: Cell+Balancing_Interface.SchDoc]

### Parts
P1  Series: DuraClik  (hidden comment: CONN 7POS DURA-CLIK 0.079")
P2  Series: DuraClik  (hidden comment: CONN 7POS DURA-CLIK 0.079")
Q1  MOSFET P-CH 16V 2.5A X2-DFN2015  (value not drawn)
Q2  MOSFET P-CH 16V 2.5A X2-DFN2015  (value not drawn)
Q3  MOSFET P-CH 16V 2.5A X2-DFN2015  (value not drawn)
Q4  MOSFET P-CH 16V 2.5A X2-DFN2015  (value not drawn)
Q5  MOSFET P-CH 16V 2.5A X2-DFN2015  (value not drawn)
Q6  MOSFET P-CH 16V 2.5A X2-DFN2015  (value not drawn)
Q7  MOSFET P-CH 16V 2.5A X2-DFN2015  (value not drawn)
Q8  MOSFET P-CH 16V 2.5A X2-DFN2015  (value not drawn)
Q9  MOSFET P-CH 16V 2.5A X2-DFN2015  (value not drawn)
Q10  MOSFET P-CH 16V 2.5A X2-DFN2015  (value not drawn)
Q11  MOSFET P-CH 16V 2.5A X2-DFN2015  (value not drawn)
Q12  MOSFET P-CH 16V 2.5A X2-DFN2015  (value not drawn)
R23  Resistance: 3.3k  Power: 1/4W  [RES, 0603]  (hidden comment: RES 3.3K OHM 1% 1/4W 0603)
R24  Resistance: 3.3k  Power: 1/4W  [RES, 0603]  (hidden comment: RES 3.3K OHM 1% 1/4W 0603)
R25  Resistance: 0.0  [RES, 0603]  (hidden comment: RES 0.0 OHM 1/4W 0603)
R26  Resistance: 0.0  [RES, 0603]  (hidden comment: RES 0.0 OHM 1/4W 0603)
R27  Resistance: 3.3k  Power: 1/4W  [RES, 0603]  (hidden comment: RES 3.3K OHM 1% 1/4W 0603)
R28  Resistance: 3.3k  Power: 1/4W  [RES, 0603]  (hidden comment: RES 3.3K OHM 1% 1/4W 0603)
R29  Resistance: 0.0  [RES, 0603]  (hidden comment: RES 0.0 OHM 1/4W 0603)
R30  Resistance: 0.0  [RES, 0603]  (hidden comment: RES 0.0 OHM 1/4W 0603)
R31  Resistance: 3.3k  Power: 1/4W  [RES, 0603]  (hidden comment: RES 3.3K OHM 1% 1/4W 0603)
R32  Resistance: 3.3k  Power: 1/4W  [RES, 0603]  (hidden comment: RES 3.3K OHM 1% 1/4W 0603)
R33  Resistance: 0.0  [RES, 0603]  (hidden comment: RES 0.0 OHM 1/4W 0603)
R34  Resistance: 0.0  [RES, 0603]  (hidden comment: RES 0.0 OHM 1/4W 0603)
R35  Resistance: 3.3k  Power: 1/4W  [RES, 0603]  (hidden comment: RES 3.3K OHM 1% 1/4W 0603)
R36  Resistance: 3.3k  Power: 1/4W  [RES, 0603]  (hidden comment: RES 3.3K OHM 1% 1/4W 0603)
R37  Resistance: 0.0  [RES, 0603]  (hidden comment: RES 0.0 OHM 1/4W 0603)
R38  Resistance: 0.0  [RES, 0603]  (hidden comment: RES 0.0 OHM 1/4W 0603)
R39  Resistance: 3.3k  Power: 1/4W  [RES, 0603]  (hidden comment: RES 3.3K OHM 1% 1/4W 0603)
R40  Resistance: 3.3k  Power: 1/4W  [RES, 0603]  (hidden comment: RES 3.3K OHM 1% 1/4W 0603)
R41  Resistance: 0.0  [RES, 0603]  (hidden comment: RES 0.0 OHM 1/4W 0603)
R42  Resistance: 0.0  [RES, 0603]  (hidden comment: RES 0.0 OHM 1/4W 0603)
R43  Resistance: 3.3k  Power: 1/4W  [RES, 0603]  (hidden comment: RES 3.3K OHM 1% 1/4W 0603)
R44  Resistance: 3.3k  Power: 1/4W  [RES, 0603]  (hidden comment: RES 3.3K OHM 1% 1/4W 0603)
R45  Resistance: 0.0  [RES, 0603]  (hidden comment: RES 0.0 OHM 1/4W 0603)
R46  Resistance: 0.0  [RES, 0603]  (hidden comment: RES 0.0 OHM 1/4W 0603)

### Ports
Balancing_Interface (harness Balancing_Interface), Cell_Interface (harness Cell_Interface)

### Harnesses
Cell_Interface: C12, C11, C10, C9, C8, C7, C6, C5, C4, C3, C2, C1, C0
Balancing_Interface: S12, S11, S10, S9, S8, S7, S6, S5, S4, S3, S2, S1

### Nets
C0: P2.7 R46.2 ; port Cell_Interface.C0
C1: P2.6 Q12.2(S) R42.2 ; port Cell_Interface.C1
C2: P2.5 Q10.2(S) R38.2 ; port Cell_Interface.C2
C3: P2.4 Q8.2(S) R34.2 ; port Cell_Interface.C3
C4: P2.3 Q6.2(S) R30.2 ; port Cell_Interface.C4
C5: P2.2 Q4.2(S) R26.2 ; port Cell_Interface.C5
C6: P1.7 P2.1 Q2.2(S) R45.2 ; port Cell_Interface.C6
C7: P1.6 Q11.2(S) R41.2 ; port Cell_Interface.C7
C8: P1.5 Q9.2(S) R37.2 ; port Cell_Interface.C8
C9: P1.4 Q7.2(S) R33.2 ; port Cell_Interface.C9
C10: P1.3 Q5.2(S) R29.2 ; port Cell_Interface.C10
C11: P1.2 Q3.2(S) R25.2 ; port Cell_Interface.C11
C12: P1.1 Q1.2(S) ; port Cell_Interface.C12
S1: R44.1 ; port Balancing_Interface.S1
S2: R40.1 ; port Balancing_Interface.S2
S3: R36.1 ; port Balancing_Interface.S3
S4: R32.1 ; port Balancing_Interface.S4
S5: R28.1 ; port Balancing_Interface.S5
S6: R24.1 ; port Balancing_Interface.S6
S7: R43.1 ; port Balancing_Interface.S7
S8: R39.1 ; port Balancing_Interface.S8
S9: R35.1 ; port Balancing_Interface.S9
S10: R31.1 ; port Balancing_Interface.S10
S11: R27.1 ; port Balancing_Interface.S11
S12: R23.1 ; port Balancing_Interface.S12
NetQ1_1: Q1.1(G) R23.2
NetQ1_3: Q1.3(D) R25.1
NetQ2_1: Q2.1(G) R24.2
NetQ2_3: Q2.3(D) R26.1
NetQ3_1: Q3.1(G) R27.2
NetQ3_3: Q3.3(D) R29.1
NetQ4_1: Q4.1(G) R28.2
NetQ4_3: Q4.3(D) R30.1
NetQ5_1: Q5.1(G) R31.2
NetQ5_3: Q5.3(D) R33.1
NetQ6_1: Q6.1(G) R32.2
NetQ6_3: Q6.3(D) R34.1
NetQ7_1: Q7.1(G) R35.2
NetQ7_3: Q7.3(D) R37.1
NetQ8_1: Q8.1(G) R36.2
NetQ8_3: Q8.3(D) R38.1
NetQ9_1: Q9.1(G) R39.2
NetQ9_3: Q9.3(D) R41.1
NetQ10_1: Q10.1(G) R40.2
NetQ10_3: Q10.3(D) R42.1
NetQ11_1: Q11.1(G) R43.2
NetQ11_3: Q11.3(D) R45.1
NetQ12_1: Q12.1(G) R44.2
NetQ12_3: Q12.3(D) R46.1

### Notes on the sheet
- Cell Inputs
- (near P1) 7 - 12
- (near P2) 1 - 6
- Project:
- Title:
- Size:
- Project Lead:
- Letter
- Revision:
- University of Waterloo
- 200 University Ave W
- Waterloo, ON, Canada
- N2L 3E9
- Date:
- Sheet
- of
- Website:

### Library data of the parts
P1 P2 = CONN 7POS DURA-CLIK 0.079": 7 Positions Header Connector 0.079" (2.00mm) Surface Mount Tin; Manufacturer 1: Molex, LLC; Manufacturer Part Number 1: 5600200720; Style: Board to Cable/Wire; Shrouding: Shrouded - 4 Wall; Number of Positions: 7; Number of Positions Loaded: All; Mated Stacking Heights: 9.3mm; Supplier 1: Digi-Key; Supplier Part Number 1: WM10867CT-ND; Packaging: Cut Tape (CT); Part Status: Active; Connector Type: Header; Contact Type: Male Pin; Pitch - Mating: 0.079" (2.00mm); Number of Rows: 1; Row Spacing - Mating: -; Mounting Type: Surface Mount; Termination: Solder; Fastening Type: Latch Lock; Contact Length - Mating: -; Contact Length - Post: -; Overall Contact Length: -; Insulation Height: 0.315" (8.00mm); Contact Shape: Square; Contact Finish - Mating: Tin; Contact Finish Thickness - Mating: -; Contact Finish - Post: Tin; Contact Material: Copper Alloy; Insulation Material: Polyamide (PA), Nylon; Operating Temperature: -; Ingress Protection: -; Material Flammability Rating: -; Insulation Color: Natural; Current Rating: -; Contact Finish Thickness - Post: -; ComponentLink1URL: http://www.molex.com/pdm_docs/sd/5600200720_sd.pdf; ComponentLink1Description: http://www.molex.com/pdm_docs/sd/5600200720_sd.pdf; Voltage: -
Q1-Q12 = MOSFET P-CH 16V 2.5A X2-DFN2015: P-Channel 16V 2.5A (Ta) 650mW (Ta) Surface Mount X2-DFN2015-3; Manufacturer 1: Diodes Incorporated; Manufacturer Part Number 1: DMG3415UFY4Q-7; Drive Voltage (Max Rds On,  Min Rds On): 1.8V, 4.5V; Vgs(th) (Max) @ Id: 1V @ 250µA; Gate Charge (Qg) (Max) @ Vgs: 10nC @ 4.5V; Input Capacitance (Ciss) (Max) @ Vds: 282pF @ 10V; Vgs (Max): ±8V; Rds On (Max) @ Id, Vgs: 39 mOhm @ 4A, 4.5V; Supplier 1: Digi-Key; Supplier Part Number 1: DMG3415UFY4Q-7DICT-ND; Packaging: Cut Tape (CT); Part Status: Active; FET Type: P-Channel; Technology: MOSFET (Metal Oxide); Drain to Source Voltage (Vdss): 16V; Current - Continuous Drain (Id) @ 25°C: 2.5A (Ta); FET Feature: -; Power Dissipation (Max): 650mW (Ta); Operating Temperature: -55°C ~ 150°C (TJ); Mounting Type: Surface Mount; Supplier Device Package: X2-DFN2015-3; Package / Case: 3-XFDFN; ComponentLink1URL: https://www.diodes.com/assets/Datasheets/DMG3415UFY4Q.pdf; ComponentLink1Description: https://www.diodes.com/assets/Datasheets/DMG3415UFY4Q.pdf
R23 R24 R27 R28 R31 R32 R35 R36 R39 R40 R43 R44 = RES 3.3K OHM 1% 1/4W 0603: 3.3k Ohm ±1% 0.25W, 1/4W Chip Resistor 0603 (1608 Metric) Automotive AEC-Q200, Pulse Withstanding Thick Film; Manufacturer 1: Panasonic Electronic Components; Manufacturer Part Number 1: ERJ-PA3F3301V; Temperature Coefficient: ±100ppm/°C; Supplier 1: Digi-Key; Supplier Part Number 1: P3.3KBYCT-ND; Packaging: Cut Tape (CT); Part Status: Active; Composition: Thick Film; Operating Temperature: -55°C ~ 155°C; Package / Case: 0603 (1608 Metric); Supplier Device Package: 0603; Size / Dimension: 0.063" L x 0.031" W (1.60mm x 0.80mm); Height - Seated (Max): 0.022" (0.55mm); Failure Rate: -; ComponentLink1URL: https://industrial.panasonic.com/cdbs/www-data/pdf/RDO0000/AOA0000C291.pdf; ComponentLink1Description: https://industrial.panasonic.com/cdbs/www-data/pdf/RDO0000/AOA0000C291.pdf; Tolerance: ±1%
R25 R26 R29 R30 R33 R34 R37 R38 R41 R42 R45 R46 = RES 0.0 OHM 1/4W 0603: as R2 on sheet AFE; Supplier 1: Digi-Key; Supplier Part Number 1: 541-0.0SBCT-ND; Packaging: Cut Tape (CT); Part Status: Active; Composition: Thick Film; Operating Temperature: -55°C ~ 155°C; Package / Case: 0603 (1608 Metric); Supplier Device Package: 0603; Size / Dimension: 0.063" L x 0.033" W (1.60mm x 0.85mm); Height - Seated (Max): 0.022" (0.55mm); Failure Rate: -; ComponentLink1URL: http://www.vishay.com/docs/20043/crcwhpe3.pdf; ComponentLink1Description: http://www.vishay.com/docs/20043/crcwhpe3.pdf; Power (Watts): 1/4W

## Sheet Thermistor_Interface.SchDoc
size Letter; Website: www.uwmidsun.com
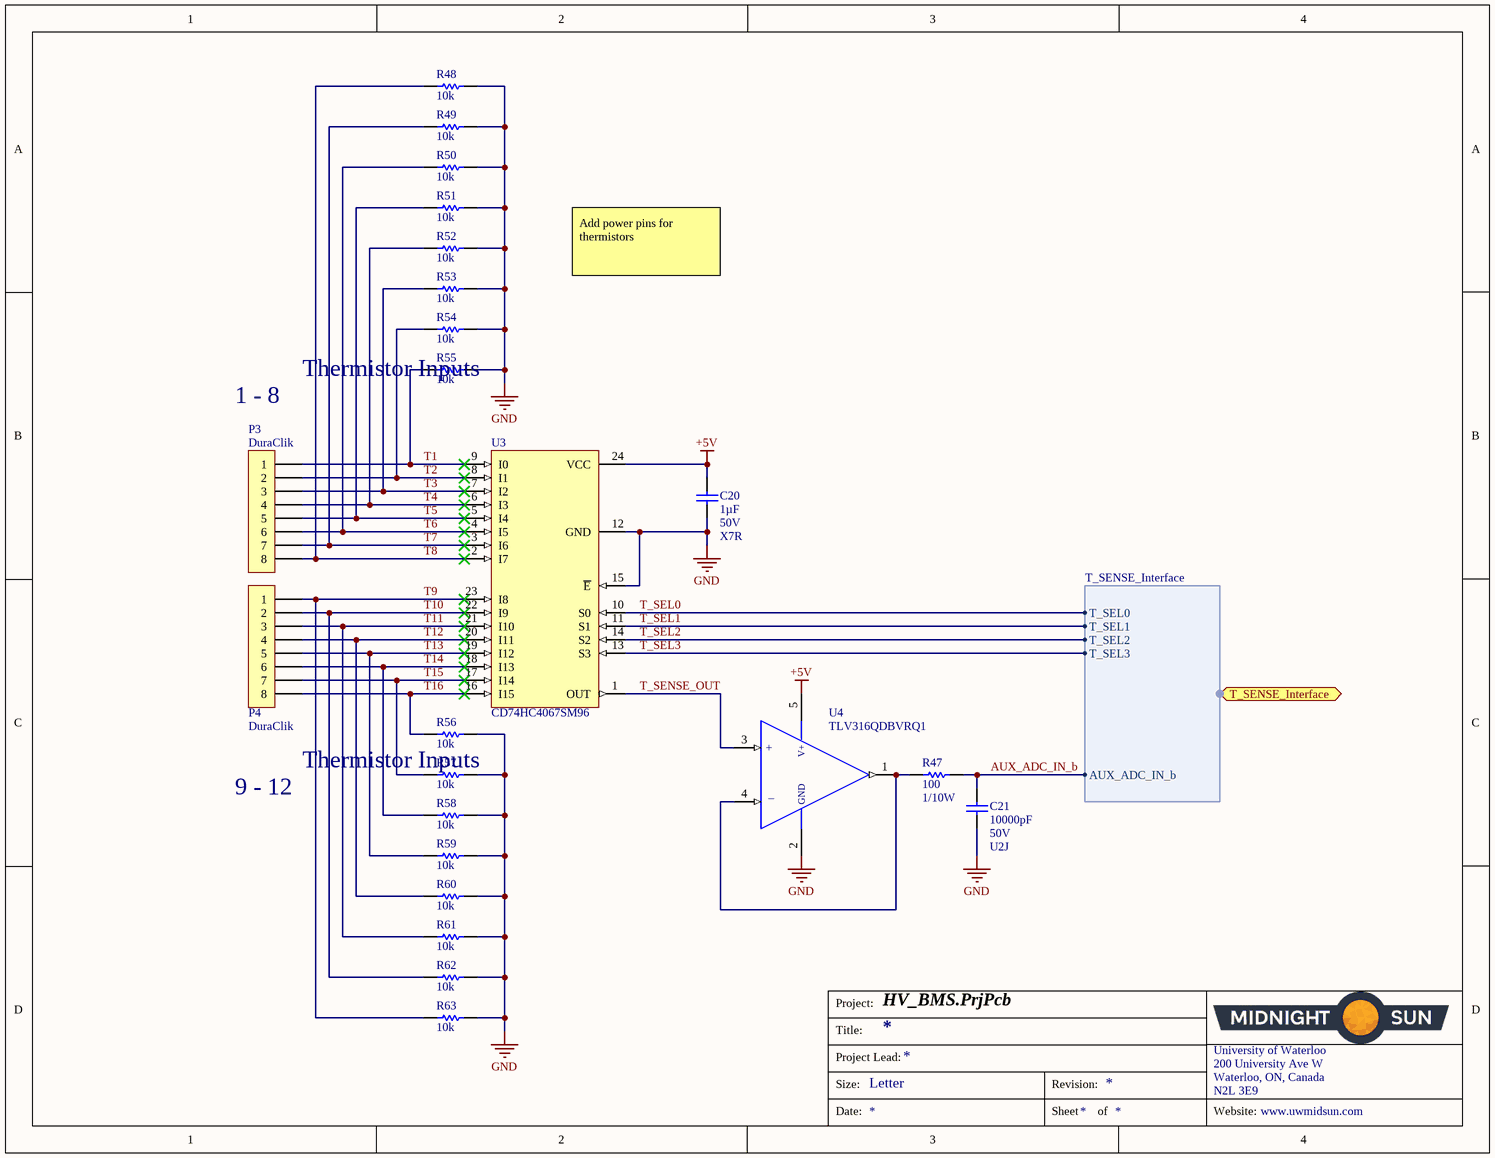
[diagram p2: Thermistor_Interface.SchDoc]

### Parts
C20  Capacitance: 1µF  Voltage: 50V  Temperature Coefficient: X7R  [CAP, 0603]  (hidden comment: CAP CER 1UF 50V 10% X7R 0603)
C21  Capacitance: 10000pF  Voltage: 50V  Temperature Coefficient: U2J  [CAP, 0603]  (hidden comment: CAP CER 10nF 50V 5% X7R 0603)
P3  Series: DuraClik  (hidden comment: CONN 8POS DURA-CLIK 0.079")
P4  Series: DuraClik  (hidden comment: CONN 8POS DURA-CLIK 0.079")
R47  Resistance: 100  Power: 1/10W  [RES, 0603]  (hidden comment: RES 100 OHM 1% 1/10W 0603)
R48  Resistance: 10k  [RES, 0603]  (hidden comment: RES 10K OHM 1% 1/10W 0603)
R49  Resistance: 10k  [RES, 0603]  (hidden comment: RES 10K OHM 1% 1/10W 0603)
R50  Resistance: 10k  [RES, 0603]  (hidden comment: RES 10K OHM 1% 1/10W 0603)
R51  Resistance: 10k  [RES, 0603]  (hidden comment: RES 10K OHM 1% 1/10W 0603)
R52  Resistance: 10k  [RES, 0603]  (hidden comment: RES 10K OHM 1% 1/10W 0603)
R53  Resistance: 10k  [RES, 0603]  (hidden comment: RES 10K OHM 1% 1/10W 0603)
R54  Resistance: 10k  [RES, 0603]  (hidden comment: RES 10K OHM 1% 1/10W 0603)
R55  Resistance: 10k  [RES, 0603]  (hidden comment: RES 10K OHM 1% 1/10W 0603)
R56  Resistance: 10k  [RES, 0603]  (hidden comment: RES 10K OHM 1% 1/10W 0603)
R57  Resistance: 10k  [RES, 0603]  (hidden comment: RES 10K OHM 1% 1/10W 0603)
R58  Resistance: 10k  [RES, 0603]  (hidden comment: RES 10K OHM 1% 1/10W 0603)
R59  Resistance: 10k  [RES, 0603]  (hidden comment: RES 10K OHM 1% 1/10W 0603)
R60  Resistance: 10k  [RES, 0603]  (hidden comment: RES 10K OHM 1% 1/10W 0603)
R61  Resistance: 10k  [RES, 0603]  (hidden comment: RES 10K OHM 1% 1/10W 0603)
R62  Resistance: 10k  [RES, 0603]  (hidden comment: RES 10K OHM 1% 1/10W 0603)
R63  Resistance: 10k  [RES, 0603]  (hidden comment: RES 10K OHM 1% 1/10W 0603)
U3  Manufacturer Part Number 1: CD74HC4067SM96  (hidden comment: IC MUX/DEMUX 1X16 24SSOP)
U4  Manufacturer Part Number 1: TLV316QDBVRQ1  [IC OP AMP GP RR 10MHZ SOT-23-5]

### Ports
T_SENSE_Interface (harness T_SENSE_Interface)

### Harnesses
T_SENSE_Interface: AUX_ADC_IN_b, T_SEL0, T_SEL1, T_SEL2, T_SEL3

### Nets
+5V: C20.1 U3.24(VCC) U4.5(VDD)
GND: C20.2 C21.2 R48.2 R49.2 R50.2 R51.2 R52.2 R53.2 R54.2 R55.2 R56.2 R57.2 R58.2 R59.2 R60.2 R61.2 R62.2 R63.2 U3.12(GND) U3.15(~{E}) U4.2(VSS)
AUX_ADC_IN_b: C21.1 R47.2 ; port T_SENSE_Interface.AUX_ADC_IN_b
T1: P3.1 R55.1 U3.9(I0)
T2: P3.2 R54.1 U3.8(I1)
T3: P3.3 R53.1 U3.7(I2)
T4: P3.4 R52.1 U3.6(I3)
T5: P3.5 R51.1 U3.5(I4)
T6: P3.6 R50.1 U3.4(I5)
T7: P3.7 R49.1 U3.3(I6)
T8: P3.8 R48.1 U3.2(I7)
T9: P4.1 R63.1 U3.23(I8)
T10: P4.2 R62.1 U3.22(I9)
T11: P4.3 R61.1 U3.21(I10)
T12: P4.4 R60.1 U3.20(I11)
T13: P4.5 R59.1 U3.19(I12)
T14: P4.6 R58.1 U3.18(I13)
T15: P4.7 R57.1 U3.17(I14)
T16: P4.8 R56.1 U3.16(I15)
T_SEL0: U3.10(S0) ; port T_SENSE_Interface.T_SEL0
T_SEL1: U3.11(S1) ; port T_SENSE_Interface.T_SEL1
T_SEL2: U3.14(S2) ; port T_SENSE_Interface.T_SEL2
T_SEL3: U3.13(S3) ; port T_SENSE_Interface.T_SEL3
T_SENSE_OUT: U3.1(OUT) U4.3(+IN)
NetR47_1: R47.1 U4.1(OUTPUT) U4.4(-IN)

### Notes on the sheet
- Add power pins for thermistors
- 1 - 8
- Thermistor Inputs
- 9 - 12
- Project:
- Title:
- Size:
- Project Lead:
- Letter
- Revision:
- University of Waterloo
- 200 University Ave W
- Waterloo, ON, Canada
- N2L 3E9
- Date:
- Sheet
- of
- Website:
- (in symbol IC OP AMP GEN PURPOSE RR 10MHZ SOT-23-5) V+; +; GND; _

### Library data of the parts
C20 = CAP CER 1UF 50V 10% X7R 0603: as C1 on sheet AFE; Supplier 1: Digi-Key; Supplier Part Number 1: 587-3247-1-ND; Packaging: Cut Tape (CT); Part Status: Active; Operating Temperature: -55°C ~ 125°C; Ratings: -; Mounting Type: Surface Mount, MLCC; Package / Case: 0603 (1608 Metric); Size / Dimension: 0.063" L x 0.031" W (1.60mm x 0.80mm); Height - Seated (Max): -; Thickness (Max): 0.037" (0.95mm); Lead Spacing: -; Lead Style: -; ComponentLink1URL: http://www.yuden.co.jp/productdata/catalog/en/mlcc_all_e.pdf; ComponentLink1Description: http://www.yuden.co.jp/productdata/catalog/en/mlcc_all_e.pdf; Tolerance: ±10%
C21 = CAP CER 10nF 50V 5% X7R 0603: as C5 on sheet AFE; Supplier 1: Digi-Key; Supplier Part Number 1: 399-13384-1-ND; Packaging: Cut Tape (CT); Part Status: Active; Operating Temperature: -55°C ~ 125°C; Ratings: -; Failure Rate: -; Mounting Type: Surface Mount, MLCC; Package / Case: 0603 (1608 Metric); Size / Dimension: 0.063" L x 0.032" W (1.60mm x 0.80mm); Height - Seated (Max): -; Thickness (Max): 0.034" (0.87mm); Lead Spacing: -; Lead Style: -; ComponentLink1URL: http://www.kemet.com/docfinder?Partnumber=C0603C103J5JAC7867; ComponentLink1Description: http://www.kemet.com/docfinder?Partnumber=C0603C103J5JAC7867; Tolerance: ±5%
P3 P4 = CONN 8POS DURA-CLIK 0.079": 8 Positions Header Connector 0.079" (2.00mm) Surface Mount Tin; Manufacturer 1: Molex, LLC; Manufacturer Part Number 1: 5600200820; Style: Board to Cable/Wire; Shrouding: Shrouded - 4 Wall; Number of Positions: 8; Number of Positions Loaded: All; Mated Stacking Heights: 9.3mm; Supplier 1: Digi-Key; Supplier Part Number 1: WM10868CT-ND; Packaging: Cut Tape (CT); Part Status: Active; Connector Type: Header; Contact Type: Male Pin; Pitch - Mating: 0.079" (2.00mm); Number of Rows: 1; Row Spacing - Mating: -; Mounting Type: Surface Mount; Termination: Solder; Fastening Type: Latch Lock; Contact Length - Mating: -; Contact Length - Post: -; Overall Contact Length: -; Insulation Height: 0.315" (8.00mm); Contact Shape: Square; Contact Finish - Mating: Tin; Contact Finish Thickness - Mating: -; Contact Finish - Post: Tin; Contact Material: Copper Alloy; Insulation Material: Polyamide (PA), Nylon; Operating Temperature: -; Ingress Protection: -; Material Flammability Rating: -; Insulation Color: Natural; Current Rating: -; Contact Finish Thickness - Post: -; ComponentLink1URL: http://www.molex.com/pdm_docs/sd/5600200820_sd.pdf; ComponentLink1Description: http://www.molex.com/pdm_docs/sd/5600200820_sd.pdf; Voltage: -
R47 = RES 100 OHM 1% 1/10W 0603: as R6 on sheet AFE; Supplier 1: Digi-Key; Supplier Part Number 1: 311-100HRCT-ND; Packaging: Cut Tape (CT); Part Status: Active; Composition: Thick Film; Operating Temperature: -55°C ~ 155°C; Package / Case: 0603 (1608 Metric); Supplier Device Package: 0603; Size / Dimension: 0.063" L x 0.031" W (1.60mm x 0.80mm); Height - Seated (Max): 0.022" (0.55mm); Failure Rate: -; ComponentLink1URL: http://www.yageo.com/documents/recent/PYu-RC_Group_51_RoHS_L_7.pdf; ComponentLink1Description: http://www.yageo.com/documents/recent/PYu-RC_Group_51_RoHS_L_7.pdf; Tolerance: ±1%
R48-R63 = RES 10K OHM 1% 1/10W 0603: as R1 on sheet AFE; Supplier 1: Digi-Key; Supplier Part Number 1: 311-10.0KHRCT-ND; Packaging: Cut Tape (CT); Part Status: Active; Composition: Thick Film; Operating Temperature: -55°C ~ 155°C; Package / Case: 0603 (1608 Metric); Supplier Device Package: 0603; Size / Dimension: 0.063" L x 0.031" W (1.60mm x 0.80mm); Height - Seated (Max): 0.022" (0.55mm); Failure Rate: -; ComponentLink1URL: http://www.yageo.com/documents/recent/PYu-RC_Group_51_RoHS_L_7.pdf; ComponentLink1Description: http://www.yageo.com/documents/recent/PYu-RC_Group_51_RoHS_L_7.pdf; Tolerance: ±1%; Power: 1/10W
U3 = IC MUX/DEMUX 1X16 24SSOP: 1 Circuit IC Switch 16:1 160 Ohm 24-SSOP; Manufacturer 1: Texas Instruments; Number of Circuits: 1; On-State Resistance (Max): 160 Ohm; Channel-to-Channel Matching (&Delta;Ron): 8.5 Ohm; Voltage - Supply, Single (V+): 2 V ~ 6 V; Switch Time (Ton, Toff) (Max): 51ns, 49ns; -3db Bandwidth: 89MHz; Channel Capacitance (CS(off), CD(off)): 5pF, 50pF; Current - Leakage (IS(off)) (Max): 800nA; Supplier 1: Digi-Key; Supplier Part Number 1: 296-9226-1-ND; Packaging: Cut Tape (CT); Part Status: Active; Switch Circuit: -; Multiplexer/Demultiplexer Circuit: 16:1; Voltage - Supply, Dual (V±): -; Charge Injection: -; Crosstalk: -; Operating Temperature: -55°C ~ 125°C (TA); Package / Case: 24-SSOP (0.209", 5.30mm Width); Supplier Device Package: 24-SSOP; ComponentLink1URL: http://www.ti.com/lit/ds/symlink/cd74hc4067.pdf; ComponentLink1Description: http://www.ti.com/lit/ds/symlink/cd74hc4067.pdf
U4 = IC OP AMP GEN PURPOSE RR 10MHZ SOT-23-5: General Purpose Amplifier 1 Circuit Rail-to-Rail SOT-23-5; Manufacturer 1: Texas Instruments; Description 1: IC OP AMP GP RR 10MHZ 5-SOT-23; Number of Circuits: 1; Slew Rate: 6 V/µs; Current - Supply: 400µA; Current - Output / Channel: 50mA; Voltage - Supply, Single/Dual (±): 1.8 V ~ 5.5 V, ±0.9 V ~ 2.75 V; Supplier 1: Digi-Key; Supplier Part Number 1: 296-45323-1-ND; RoHS: RoHS Compliant; Category: Integrated Circuits (ICs); Stock 1: 1747; Pricing 1: 1=1.33, 10=1.185, 100=0.9234, 500=0.76276, 1000=0.60218 (CAD); Packaging: Cut Tape (CT); Part Status: Active; Amplifier Type: General Purpose; Output Type: Rail-to-Rail; -3db Bandwidth: -; Operating Temperature: -40°C ~ 125°C; Mounting Type: Surface Mount; Package / Case: SC-74A, SOT-753; Supplier Device Package: SOT-23-5; ComponentLink1URL: http://www.ti.com/lit/ds/symlink/tlv316-q1.pdf; ComponentLink1Description: http://www.ti.com/lit/ds/symlink/tlv316-q1.pdf